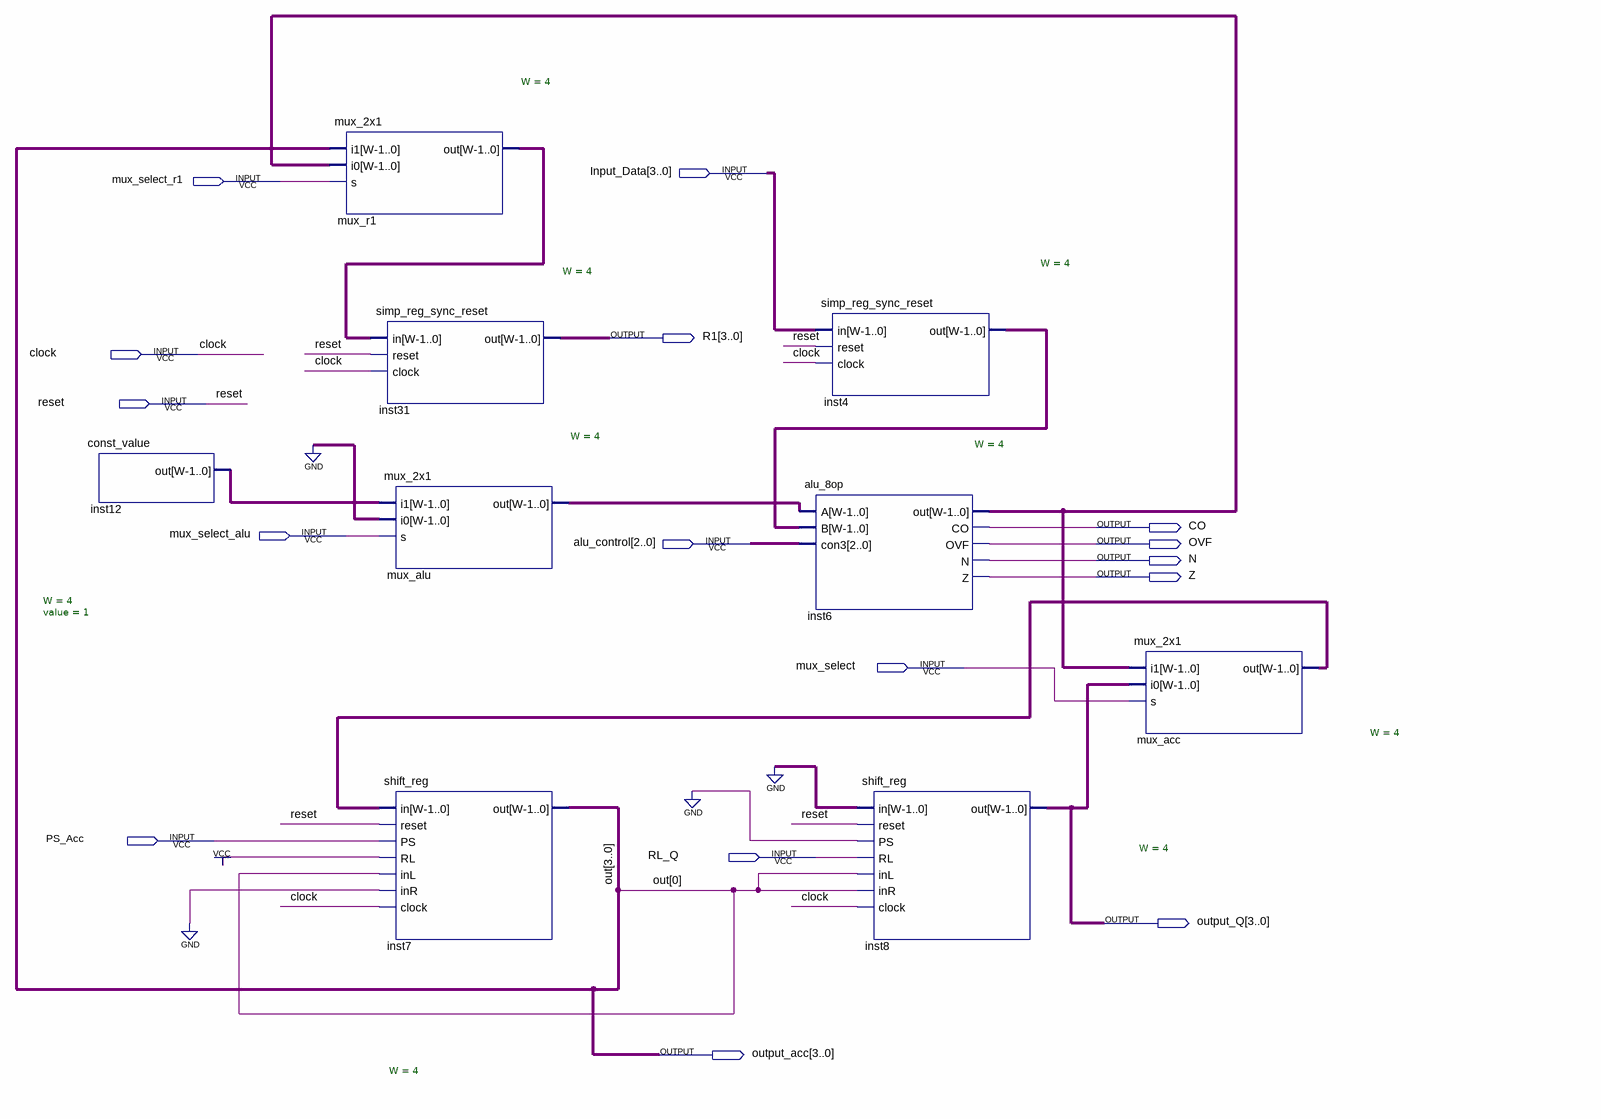
[diagram p0: schematic sheet]
// Quartus schematic datapath_design.bdf as structural Verilog: 9 symbols, 16 pins
module datapath_design (
  input  [3:0] Input_Data,
  input  mux_select_r1,
  input  clock,
  input  reset,
  input  mux_select_alu,
  input  [2:0] alu_control,
  input  mux_select,
  input  PS_Acc,
  input  RL_Q,
  output [3:0] R1,
  output CO,
  output OVF,
  output N,
  output Z,
  output [3:0] output_Q,
  output [3:0] output_acc
);

  wire [3:0] inst4_out, inst6_out, inst12_out, mux_acc_out, mux_alu_out, mux_r1_out;

  const_value #(.W(4), .value(1)) inst12 (.out(inst12_out));
  mux_2x1 #(.W(4)) mux_r1 (.i1(output_acc), .i0(inst6_out), .s(mux_select_r1), .out(mux_r1_out));
  simp_reg_sync_reset #(.W(4)) inst31 (.in(mux_r1_out), .reset(reset), .clock(clock), .out(R1));
  mux_2x1 #(.W(4)) mux_alu (.i1(inst12_out), .i0(4'b0000), .s(mux_select_alu), .out(mux_alu_out));
  shift_reg #(.W(4)) inst7 (
    .in(mux_acc_out), .reset(reset), .PS(PS_Acc), .RL(1'b1), .inL(output_acc[0]), .inR(1'b0), .clock(clock),
    .out(output_acc));
  simp_reg_sync_reset #(.W(4)) inst4 (.in(Input_Data), .reset(reset), .clock(clock), .out(inst4_out));
  alu_8op #(.W(4)) inst6 (
    .A(mux_alu_out), .B(inst4_out), .con3(alu_control), .out(inst6_out), .CO(CO), .OVF(OVF), .N(N), .Z(Z));
  shift_reg #(.W(4)) inst8 (
    .in(4'b0000), .reset(reset), .PS(1'b0), .RL(RL_Q), .inL(output_acc[0]), .inR(output_acc[0]),
    .clock(clock), .out(output_Q));
  mux_2x1 #(.W(4)) mux_acc (.i1(inst6_out), .i0(output_Q), .s(mux_select), .out(mux_acc_out));

  // Other names for the same wires on the sheet: out[3:0] = output_acc
endmodule
